# EAGLE design temp_controller_v1 (EAGLE 5.07)
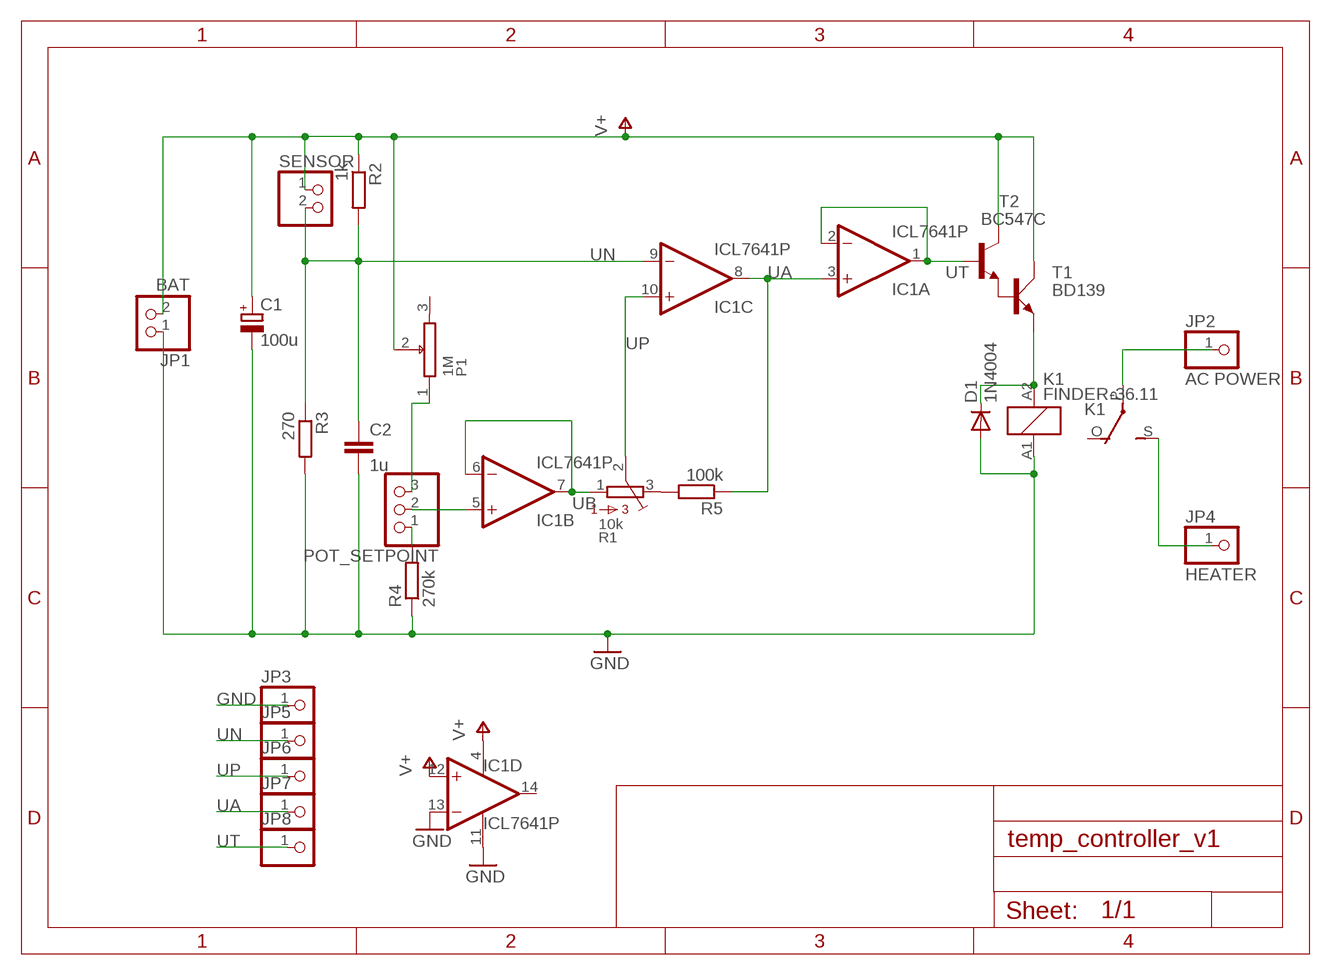
[diagram p0: schematic, sheet 1]

## Parts
C1  100u  CPOL-EUE2.5-6  [E2,5-6]
C2  1u  C-EU050-024X044  [C050-024X044]
D1  1N4004  [DO41-10]
IC1  ICL7641P  [DIL14]
JP1  BAT  PINHD-1X2  [1X02]
JP2  AC POWER  PINHD-1X1  [1X01]
JP3  PINHD-1X1  [1X01]
JP4  HEATER  PINHD-1X1  [1X01]
JP5  PINHD-1X1  [1X01]
JP6  PINHD-1X1  [1X01]
JP7  PINHD-1X1  [1X01]
JP8  PINHD-1X1  [1X01]
K1  FINDER-36.11  [FINDER-36.11]
P1  1M  POTF_1  [POTF_1]
POT_SETPOINT  PINHD-1X3  [1X03]
R1  10k  3386-H  [3386H]
R2  1k  R-EU_0204/2V  [0204V]
R3  270  R-EU_0204/2V  [0204V]
R4  270k  R-EU_0204/7  [0204/7]
R5  100k  R-EU_0204/2V  [0204V]
SENSOR  PINHD-1X2  [1X02]
T1  BD139  [TO126AV]
T2  BC547C  BC547  [TO92]

## Nets
GND: C1.- C2.2 D1.A IC1.11(P:V-) IC1.13(D:-IN) JP1.1 JP3.1 K1.A1(K:A1) R3.2 R4.1
N$1: P1.1 POT_SETPOINT.3
N$2: IC1.5(B:+IN) POT_SETPOINT.2
N$3: JP2.1 K1.P(-1:P)
N$4: D1.C K1.A2(K:A2) T1.E
N$5: JP4.1 K1.S(-1:S)
N$6: R1.3 R5.2
N$7: T1.B T2.1(E)
N$8: POT_SETPOINT.1 R4.2
UA: IC1.3(A:+IN) IC1.8(C:OUT) JP7.1 R5.1
UB: IC1.6(B:-IN) IC1.7(B:OUT) R1.1
UN: C2.1 IC1.9(C:-IN) JP5.1 R2.2 R3.1 SENSOR.2
UP: IC1.10(C:+IN) JP6.1 R1.2
UT: IC1.1(A:OUT) IC1.2(A:-IN) JP8.1 T2.2(B)
V+: C1.+ IC1.4(P:V+) IC1.12(D:+IN) JP1.2 P1.2 R2.1 SENSOR.1 T1.C T2.3(C)
Unconnected: IC1.14(D:OUT) K1.O(-1:O) P1.3

## Library data of the parts
C1 = rcl:CPOL-EU: POLARIZED CAPACITOR, European symbol
C2 = rcl:C-EU: CAPACITOR, European symbol
D1 = diode:1N4004: DIODE general purpose rectifier, 1 A
IC1 = linear:ICL7641: OP AMP
JP1 SENSOR = pinhead:PINHD-1X2: PIN HEADER
JP2-JP8 = pinhead:PINHD-1X1: PIN HEADER
K1 = DIY:FINDER-36.11: Miniature PCB relays 10 A Printed circuit mount 10 A relay * 1 Pole changeover contacts or * 1 Pole normally open contact * Miniature - "Sugar cube" package * DC coil - 360 mW * Wash tight: RT III * Cadmium Free contact material option
P1 = DIY:POTF_1
POT_SETPOINT = pinhead:PINHD-1X3: PIN HEADER
R1 = BOURNS:3386-: 3386 Series 3/8" Square Trimmer
R2-R4 = rcl:R-EU_: RESISTOR, European symbol
R5 = resistor:R-EU_: RESISTOR, European symbol
T1 = transistor-power:BD139: NPN TRANSISTOR
T2 = transistor:BC547: NPN TRANSISTOR

## Board
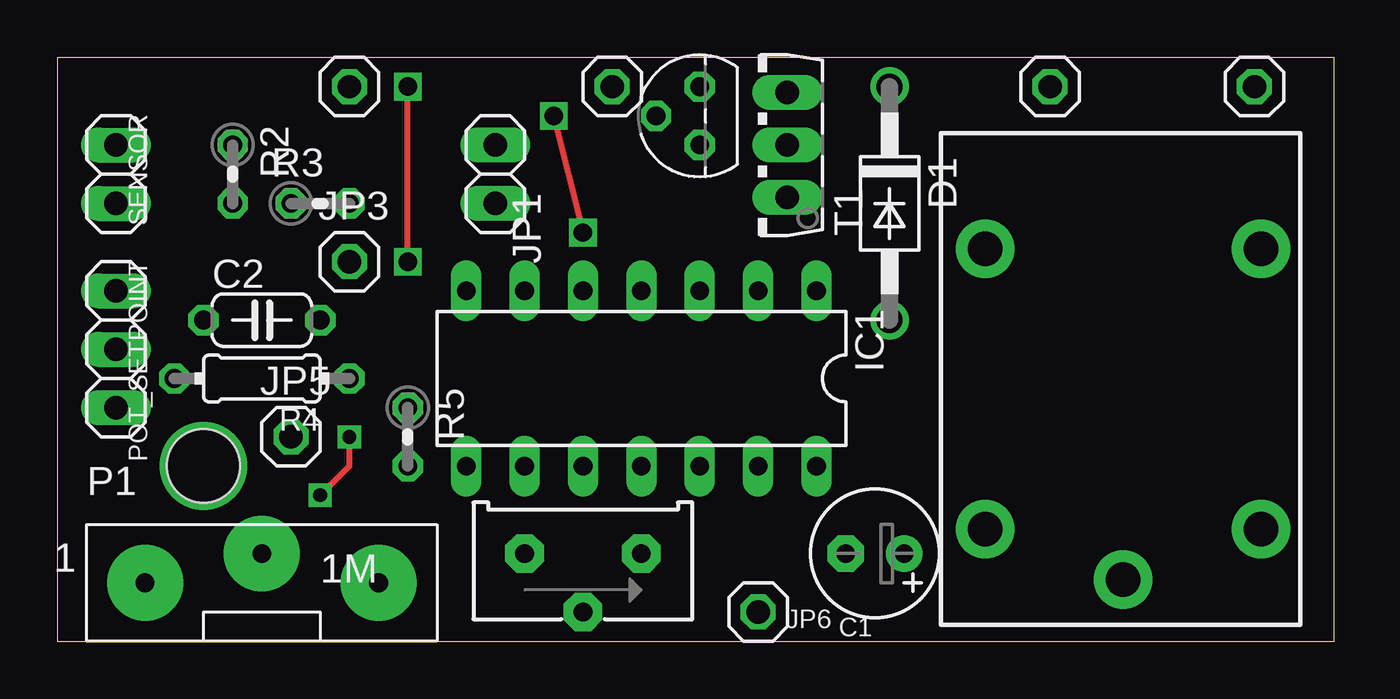
[diagram p1: board, top side]
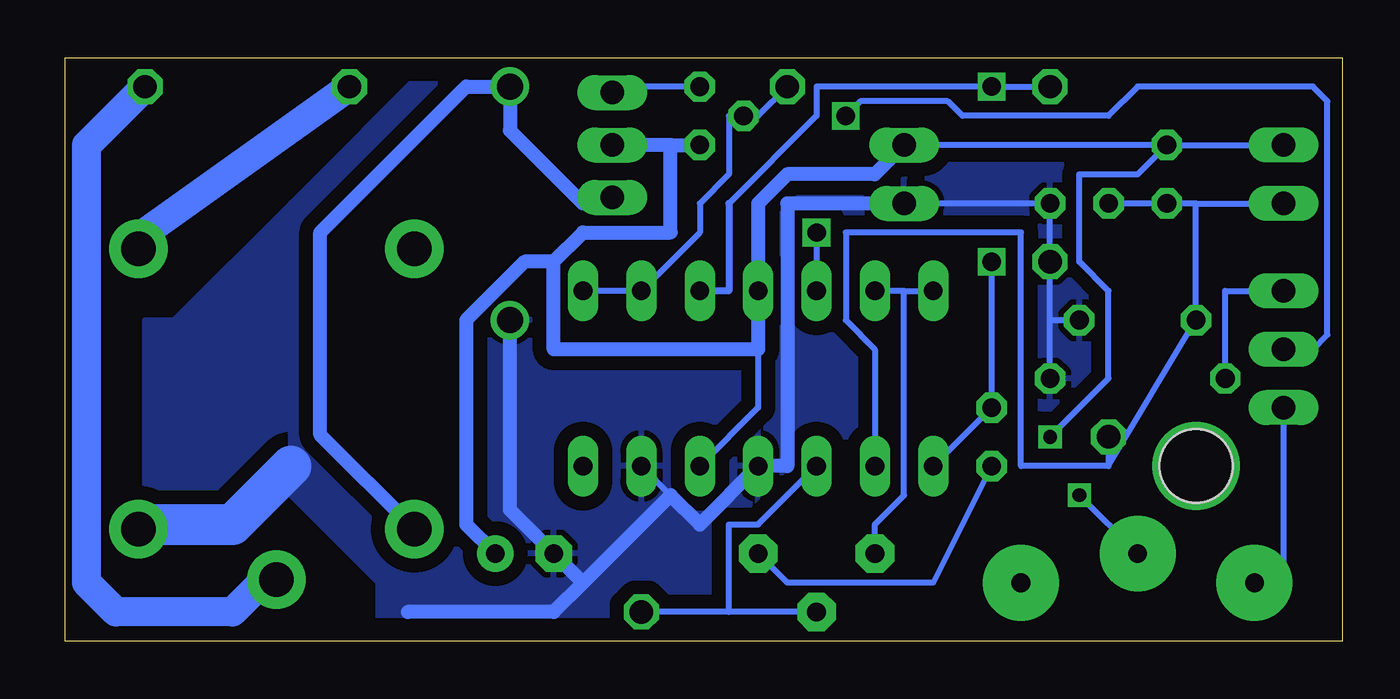
[diagram p2: board, bottom side, seen from below]

Size 55.55 x 25.39 mm. Coordinates in mm from the lower left corner, seen from the top.
Outline: 0,0 55.55,0 55.55,25.39 0,25.39 0,0
Copper layers (1*16): Top 0.035mm / dielectric 1.5mm / Bottom 0.035mm
Design rules "default": minimum track width 10mil, minimum drill 24mil, track to track 8mil, track to pad 8mil, pad to pad 8mil, via to via 8mil, smd to smd 8mil, copper to edge 40mil, drill to drill 8mil, minimum pad ring 10mil, minimum via ring 8mil, stop-mask expansion 4mil, vias tented up to drill 0mil, thermal gap 10mil
Holes 3.2 mm at 6.35,7.62

### Footprints (pad centres in the part's own frame; a part is rotated, then mirrored left to right if it is on the bottom)
E2,5-6 = drill 0.813 pad 1.6 round: + -1.27,0 | drill 0.813 pad 1.6 octagon: - 1.27,0
C050-024X044 = drill 0.813 octagon: 1 -2.54,0; 2 2.54,0
DO41-10 = drill 1.118 round: A 5.08,0; C -5.08,0
DIL14 = drill 0.813 long: 1 -7.62,-3.81; 2 -5.08,-3.81; 3 -2.54,-3.81; 4 0,-3.81; 5 2.54,-3.81; 6 5.08,-3.81; 7 7.62,-3.81; 8 7.62,3.81; 9 5.08,3.81; 10 2.54,3.81; 11 0,3.81; 12 -2.54,3.81; 13 -5.08,3.81; 14 -7.62,3.81
1X02 = drill 1.016 long: 1 -1.27,0; 2 1.27,0
1X01 = drill 1.016 octagon: 1 0,0
FINDER-36.11 = drill 1.5 pad 2.54 round: A1 -6.55,-6; A2 -6.55,6; O 5.65,6; P -8.75,0; S 5.65,-6
POTF_1 = drill 0.813 pad 3.302 round: 1 2.54,2.54; 2 7.62,3.81; 3 12.7,2.54
1X03 = drill 1.016 long: 1 -2.54,0; 2 0,0; 3 2.54,0
3386H = drill 0.813 pad 1.676 octagon: 1 -2.54,0.635; 2 0,-1.905; 3 2.54,0.635
0204V = drill 0.813 octagon: 1 -1.27,0; 2 1.27,0
0204/7 = drill 0.813 octagon: 1 -3.81,0; 2 3.81,0
TO126AV = drill 1.016 long: B 2.286,-1.27; C 0,-1.27; E -2.286,-1.27
TO92 = drill 0.813 octagon: 1 1.27,0; 2 0,1.905; 3 -1.27,0

### Placement (x,y rotation side)
C1  35.56,3.81 180 top
C2  8.89,13.97 0 top
D1  36.2,19.05 270 top
IC1  25.4,11.43 180 top
JP1  19.05,20.32 90 top
JP2  52.07,24.13 0 top
JP3  12.7,16.51 0 top
JP4  43.18,24.13 0 top
JP5  10.16,8.89 0 top
JP6  30.48,1.27 0 top
JP7  12.7,24.13 0 top
JP8  24.13,24.13 0 top
K1  46.35,11.43 90 top
P1  1.27,0 0 top
POT_SETPOINT  2.54,12.7 270 top
R1  22.86,3.17 0 top
R2  7.62,20.32 270 top
R3  11.43,19.05 0 top
R4  8.89,11.43 180 top
R5  15.24,8.89 270 top
SENSOR  2.54,20.32 270 top
T1  30.48,21.59 90 top
T2  27.94,22.86 90 top

### Tracks (layer width: path | path; a pad name or v marks a point on that pad's centre or on a via)
GND
  Bottom 0.254: 29.21,6.35 IC1.13 | R4.1 12.7,13.97 | 12.7,13.97 C2.2 | JP1.1 R3.2 12.7,13.97 | K1.A1 52.07,5.08
  Bottom 0.61: 33.02,2.54 29.21,6.35 27.94,5.08 IC1.11 24.13,7.62 24.13,19.05 JP1.1 | 33.02,2.54 34.29,1.27 40.64,1.27 | D1.A 36.2,5.71 C1.- 33.02,2.54
  Bottom 1.778: 52.07,5.08 48.26,5.08 45.72,7.62
  pour Bottom (isolate 0.61): 0,25.4 0,0 41.91,0 41.91,2.54 45.72,6.35 45.72,19.05 39.37,25.4
N$1
  Bottom 0.254: POT_SETPOINT.3 2.54,2.54 P1.1
N$2  (via drill 0.8)
  Top 0.254: v21.59,22.86 v22.86,17.78
  Bottom 0.254: v21.59,22.86 20.95,23.5 17.14,23.5 16.51,22.86 10.16,22.86 8.89,24.13 1.27,24.13 0.64,23.5 0.64,13.34 1.27,12.7 POT_SETPOINT.2 | v22.86,17.78 IC1.5
N$3
  Bottom 1.27: JP2.1 54.61,21.59 54.61,2.54 53.34,1.27 48.26,1.27 46.85,2.68 K1.P
N$4
  Bottom 0.254: 33.02,19.05 31.75,19.05
  Bottom 0.61: 31.75,19.05 T1.E | K1.A2 44.45,8.97 44.45,17.78 38.1,24.13 D1.C 36.2,22.23 33.02,19.05
N$5
  Bottom 1.27: JP4.1 52.07,17.78 K1.S
N$6
  Bottom 0.254: R5.2 17.78,2.54 24.13,2.54 R1.3
N$7
  Bottom 0.254: T2.1 31.75,24.13 T1.B
N$8
  Bottom 0.254: R4.2 5.08,15.24 POT_SETPOINT.1
N$9  (via drill 2.8)
  other vias: 6.35,7.62
N$10
  pour Bottom (isolate 0.61): 52.07,5.08 52.07,13.97 50.8,13.97 45.72,19.05 45.72,6.35 50.8,6.35
UA  (via drill 0.8)
  Top 0.254: v15.24,16.51 v15.24,24.13
  Bottom 0.254: IC1.8 R5.1 v15.24,16.51 | 26.67,19.05 22.86,22.86 22.86,24.13 v15.24,24.13 JP7.1
  Bottom 0.305: IC1.3 26.67,15.24 26.67,19.05
UB
  Bottom 0.254: 19.05,15.24 IC1.6 | 19.05,15.24 IC1.7 | R1.1 20.32,5.08 19.05,6.35 19.05,15.24
UN
  Bottom 0.254: 6.35,19.05 SENSOR.2 | 6.35,19.05 R2.2 R3.1 | 6.35,19.05 C2.1 10.16,7.62 | IC1.9 20.32,12.7 21.59,13.97 21.59,17.78 13.97,17.78 13.97,7.62 10.16,7.62 | JP5.1 10.16,7.62
UP
  Bottom 0.254: IC1.10 25.4,5.08 26.67,5.08 26.67,1.27 | R1.2 26.67,1.27 | 26.67,1.27 JP6.1
UT
  Bottom 0.254: IC1.1 IC1.2 27.94,17.78 27.94,19.05 26.67,20.32 26.67,22.86 T2.2 25.4,22.86 JP8.1
V+  (via drill 0.6)
  Top 0.254: v12.7,8.89 12.7,7.62 v11.43,6.35
  Bottom 0.254: 25.4,12.7 25.4,10.16 IC1.12 | R2.1 SENSOR.1 | R2.1 JP1.2 | R2.1 8.89,20.32 11.43,20.32 11.43,16.51 10.16,15.24 10.16,11.43 v12.7,8.89 | P1.2 v11.43,6.35
  Bottom 0.61: 29.21,21.59 T1.C | 29.21,21.59 T2.3 | 29.21,21.59 29.21,17.78 33.02,17.78 34.29,16.51 | 34.29,16.51 34.29,12.7 25.4,12.7 IC1.4 25.4,19.05 24.13,20.32 20.32,20.32 JP1.2 | 34.29,16.51 35.56,16.51 38.1,13.97 38.1,5.08 C1.+

### Text on the board
tDocu: UA | UT | LOAD | + | Martin Hans 2011 | - | sensor | Bat. 3V | GND | Heat controller v1 | setpoint | hysteresis | UN | UP | range